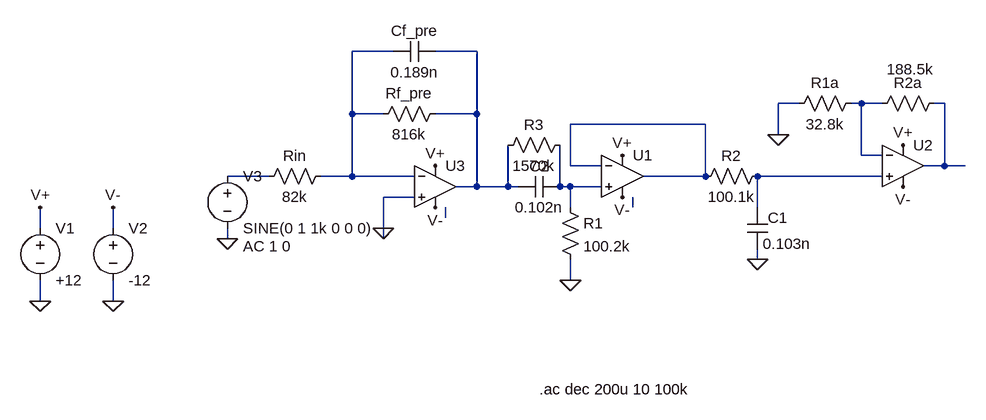
[diagram p0: schematic shaper_bode.asc]
shaper_bode.asc, the LTspice schematic file:
Version 4
SHEET 1 880 680
WIRE -704 -224 -768 -224
WIRE -576 -224 -640 -224
WIRE -80 -144 -112 -144
WIRE 16 -144 0 -144
WIRE 48 -144 16 -144
WIRE 144 -144 128 -144
WIRE -768 -128 -768 -224
WIRE -720 -128 -768 -128
WIRE -576 -128 -576 -224
WIRE -576 -128 -640 -128
WIRE -224 -112 -432 -112
WIRE -112 -96 -112 -144
WIRE 16 -64 16 -144
WIRE 48 -64 16 -64
WIRE -432 -48 -432 -112
WIRE -384 -48 -432 -48
WIRE 144 -48 144 -144
WIRE 144 -48 112 -48
WIRE 176 -48 144 -48
WIRE -896 -32 -960 -32
WIRE -768 -32 -768 -128
WIRE -768 -32 -816 -32
WIRE -672 -32 -768 -32
WIRE -224 -32 -224 -112
WIRE -224 -32 -320 -32
WIRE 48 -32 -144 -32
WIRE -576 -16 -576 -128
WIRE -576 -16 -608 -16
WIRE -528 -16 -528 -80
WIRE -528 -16 -576 -16
WIRE -512 -16 -528 -16
WIRE -448 -16 -448 -80
WIRE -432 -16 -448 -16
WIRE -384 -16 -432 -16
WIRE -672 0 -720 0
WIRE -432 16 -432 -16
WIRE -336 16 -336 0
WIRE -144 16 -144 -32
WIRE -624 32 -624 16
WIRE -1248 48 -1248 16
WIRE -1136 48 -1136 16
WIRE -720 48 -720 0
WIRE -960 64 -960 48
WIRE -720 64 -720 48
WIRE -144 96 -144 80
WIRE -432 128 -432 96
WIRE -1248 160 -1248 128
WIRE -1136 160 -1136 128
FLAG -1248 160 0
FLAG -1136 160 0
FLAG -1248 16 V+
FLAG -1136 16 V-
FLAG -352 0 V-
FLAG -352 -64 V+
FLAG -432 128 0
FLAG -144 96 0
FLAG -112 -96 0
FLAG -640 16 V-
FLAG -640 -48 V+
FLAG -720 48 0
FLAG -960 64 0
FLAG 80 -80 V+
FLAG 80 -16 V-
SYMBOL voltage -1248 32 R0
WINDOW 123 24 126 Left 2
WINDOW 39 24 111 Left 2
SYMATTR InstName V1
SYMATTR Value +12
SYMBOL voltage -1136 32 R0
WINDOW 123 24 126 Left 2
WINDOW 39 24 111 Left 2
SYMATTR InstName V2
SYMATTR Value -12
SYMBOL Opamps/UniversalOpamp2 -352 -32 R0
SYMATTR InstName U1
SYMBOL res -448 0 R0
SYMATTR InstName R1
SYMATTR Value 100.2k
SYMBOL res -128 -48 R90
WINDOW 0 0 56 VBottom 2
WINDOW 3 32 56 VTop 2
SYMATTR InstName R2
SYMATTR Value 100.1k
SYMBOL cap -160 16 R0
WINDOW 0 32 16 Left 2
SYMATTR InstName C1
SYMATTR Value 0.103n
SYMBOL cap -448 -32 R90
WINDOW 0 0 32 VBottom 2
WINDOW 3 32 32 VTop 2
SYMATTR InstName C2
SYMATTR Value 0.102n
SYMBOL Opamps/UniversalOpamp2 80 -48 R0
SYMATTR InstName U2
SYMBOL res 16 -160 R90
WINDOW 0 0 56 VBottom 2
WINDOW 3 32 56 VTop 2
SYMATTR InstName R1a
SYMATTR Value 32.8k
SYMBOL res 144 -160 R90
WINDOW 0 0 56 VBottom 2
WINDOW 3 -52 53 VTop 2
SYMATTR InstName R2a
SYMATTR Value 188.5k
SYMBOL Opamps/UniversalOpamp2 -640 -16 R0
SYMATTR InstName U3
SYMBOL voltage -960 -48 R0
WINDOW 123 24 124 Left 2
WINDOW 39 0 0 Left 0
SYMATTR InstName V3
SYMATTR Value SINE(0 1 1k 0 0 0)
SYMATTR Value2 AC 1 0
SYMBOL res -624 -144 R90
WINDOW 0 0 56 VBottom 2
WINDOW 3 32 56 VTop 2
SYMATTR InstName Rf_pre
SYMATTR Value 816k
SYMBOL res -800 -48 R90
WINDOW 0 0 56 VBottom 2
WINDOW 3 32 56 VTop 2
SYMATTR InstName Rin
SYMATTR Value 82k
SYMBOL cap -640 -240 R90
WINDOW 0 0 32 VBottom 2
WINDOW 3 32 32 VTop 2
SYMATTR InstName Cf_pre
SYMATTR Value 0.189n
SYMBOL res -432 -96 R90
WINDOW 0 0 56 VBottom 2
WINDOW 3 32 56 VTop 2
SYMATTR InstName R3
SYMATTR Value 1570k
TEXT -480 296 Left 2 !.ac dec 200u 10 100k

The netlist it stands for:
* shaper_bode.asc
V1 V+ 0 +12
V2 V- 0 -12
XU1 N008 N005 V+ V- N005 level.2 Avol=1Meg GBW=10Meg Slew=10Meg ilimit=25m rail=0 Vos=0 phimargin=45 en=0 enk=0 in=0 ink=0 Rin=500Meg  ; pins IN+ IN- V+ V- OUT
R1 N008 0 100.2k
R2 N007 N005 100.1k
C1 N007 0 0.103n
C2 N008 N002 0.102n
XU2 N007 N003 V+ V- N004 level.2 Avol=1Meg GBW=10Meg Slew=10Meg ilimit=25m rail=0 Vos=0 phimargin=45 en=0 enk=0 in=0 ink=0 Rin=500Meg  ; pins IN+ IN- V+ V- OUT
R1a N003 0 32.8k
R2a N004 N003 188.5k
XU3 0 N001 V+ V- N002 level.2 Avol=1Meg GBW=10Meg Slew=10Meg ilimit=25m rail=0 Vos=0 phimargin=45 en=0 enk=0 in=0 ink=0 Rin=500Meg  ; pins IN+ IN- V+ V- OUT
V3 N006 0 SINE(0 1 1k 0 0 0) AC 1 0
Rf_pre N002 N001 816k
Rin N001 N006 82k
Cf_pre N002 N001 0.189n
R3 N008 N002 1570k
.ac dec 200u 10 100k
.lib UniversalOpamps2.sub
.backanno
.end